# EAGLE design adapterV0.2 (EAGLE 9.4.2)
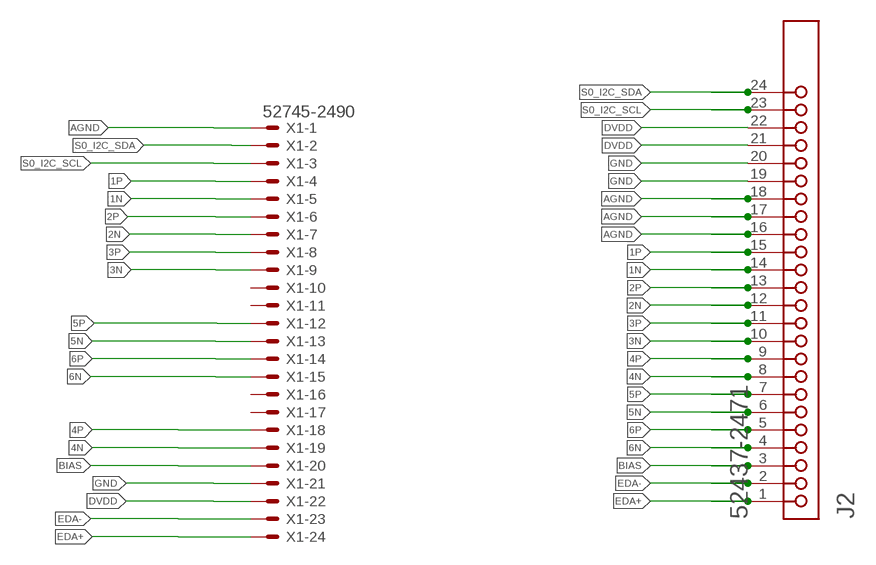
[diagram p0: schematic, sheet 1]

## Parts
J2  MOLEX_52437-247_FLEX  [MOLEX_52437-2471_FLEX]
X1  52745-2490  [52745-2490]

## Nets
1N: J2.14 X1.5
1P: J2.15 X1.4
2N: J2.12 X1.7
2P: J2.13 X1.6
3N: J2.10 X1.9
3P: J2.11 X1.8
4N: J2.8 X1.19
4P: J2.9 X1.18
5N: J2.6 X1.13
5P: J2.7 X1.12
6N: J2.4 X1.15
6P: J2.5 X1.14
AGND: J2.16 J2.17 J2.18 X1.1
BIAS: J2.3 X1.20
DVDD: J2.21 J2.22 X1.22
EDA+: J2.1 X1.24
EDA-: J2.2 X1.23
GND: J2.19 J2.20 X1.21
S0_I2C_SCL: J2.23 X1.3
S0_I2C_SDA: J2.24 X1.2
Unconnected: X1.10 X1.11 X1.16 X1.17

## Library data of the parts
J2 = Molex - 52437-2471:MOLEX_52437-247_FLEX: MOLX-52437-2471
X1 = con-molex:52745-2490: FFC/FPC-to-Board 0.50mm (.020") SMT Top Contact Right Angle, ZIF, Style Receptacle 52745 / 52435 Source: http://www.molex.com/product/ffc/52745.html; MF: MOLEX; OC_FARNELL: unknown; OC_NEWARK: unknown

## Net classes
0 default: width 0.19 mm, drill 0.19 mm

## Board
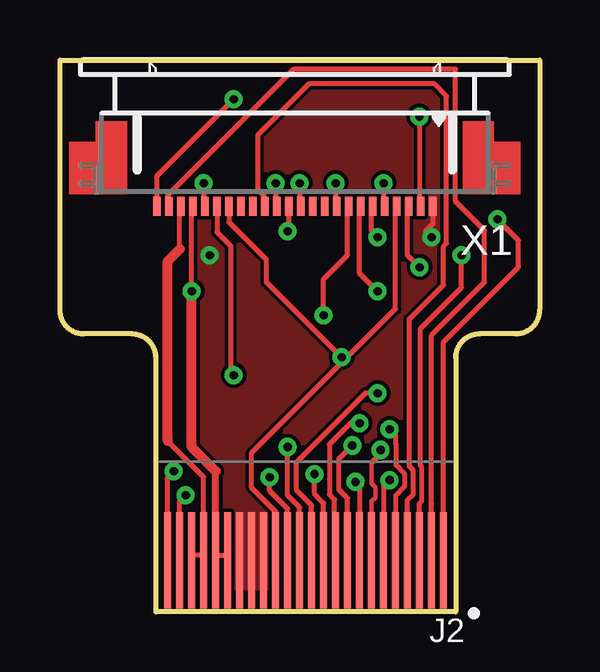
[diagram p1: board, top side]
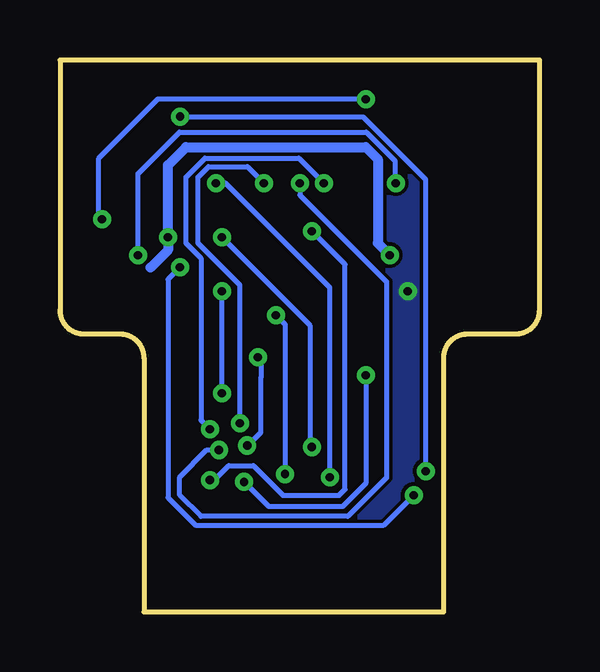
[diagram p2: board, bottom side, seen from below]

Size 20 x 23 mm. Coordinates in mm from the lower left corner, seen from the top.
Outline: 0,12.58 0,23 20,23 20,12.58 20,12.55 20,12.51 19.99,12.48 19.99,12.45 19.99,12.41 19.98,12.38 19.97,12.35 19.96,12.31 19.95,12.28 19.94,12.25 19.93,12.22 19.92,12.18 19.9,12.15 19.89,12.12 19.87,12.09 19.85,12.06 19.84,12.03 19.82,12.01 19.8,11.98 19.78,11.95 19.75,11.93 19.73,11.9 19.71,11.88 19.68,11.85 19.66,11.83 19.63,11.81 19.6,11.79 19.58,11.77 19.55,11.75 19.52,11.73 19.49,11.71 19.46,11.7 19.43,11.68 19.4,11.67 19.37,11.65 19.33,11.64 19.3,11.63 19.27,11.62 19.24,11.61 19.2,11.6 19.17,11.6 19.14,11.59 19.1,11.59 19.07,11.59 19.03,11.58 19,11.58 17.5,11.58 17.47,11.58 17.43,11.58 17.4,11.58 17.36,11.57 17.33,11.57 17.3,11.56 17.26,11.55 17.23,11.55 17.2,11.54 17.16,11.53 17.13,11.51 17.1,11.5 17.07,11.49 17.04,11.47 17.01,11.45 16.98,11.44 16.95,11.42 16.92,11.4 16.9,11.38 16.87,11.36 16.84,11.34 16.82,11.31 16.79,11.29 16.77,11.27 16.75,11.24 16.72,11.21 16.7,11.19 16.68,11.16 16.66,11.13 16.65,11.1 16.63,11.07 16.61,11.04 16.6,11.01 16.58,10.98 16.57,10.95 16.56,10.92 16.55,10.89 16.54,10.85 16.53,10.82 16.52,10.79 16.51,10.75 16.51,10.72 16.5,10.69 16.5,10.65 16.5,10.62 16.5,10.58 16.5,0 4,0 4,10.58 4,10.62 4,10.65 3.99,10.69 3.99,10.72 3.99,10.75 3.98,10.79 3.97,10.82 3.96,10.85 3.95,10.89 3.94,10.92 3.93,10.95 3.92,10.98 3.9,11.01 3.89,11.04 3.87,11.07 3.85,11.1 3.84,11.13 3.82,11.16 3.8,11.19 3.78,11.21 3.75,11.24 3.73,11.27 3.71,11.29 3.68,11.31 3.66,11.34 3.63,11.36 3.6,11.38 3.58,11.4 3.55,11.42 3.52,11.44 3.49,11.45 3.46,11.47 3.43,11.49 3.4,11.5 3.37,11.51 3.33,11.53 3.3,11.54 3.27,11.55 3.24,11.55 3.2,11.56 3.17,11.57 3.14,11.57 3.1,11.58 3.07,11.58 3.03,11.58 3,11.58 1,11.58 0.97,11.58 0.93,11.59 0.9,11.59 0.86,11.59 0.83,11.6 0.8,11.6 0.76,11.61 0.73,11.62 0.7,11.63 0.66,11.64 0.63,11.65 0.6,11.67 0.57,11.68 0.54,11.7 0.51,11.71 0.48,11.73 0.45,11.75 0.42,11.77 0.4,11.79 0.37,11.81 0.34,11.83 0.32,11.85 0.29,11.88 0.27,11.9 0.25,11.93 0.22,11.95 0.2,11.98 0.18,12.01 0.16,12.03 0.15,12.06 0.13,12.09 0.11,12.12 0.1,12.15 0.08,12.18 0.07,12.22 0.06,12.25 0.05,12.28 0.04,12.31 0.03,12.35 0.02,12.38 0.01,12.41 0.01,12.45 0,12.48 0,12.51 0,12.55 0,12.58
Copper layers (1*16): Top 0.035mm / dielectric 1.5mm / Bottom 0.035mm
Design rules "default *": minimum track width 6mil, minimum drill 0.35mm, track to track 6mil, track to pad 6mil, pad to pad 6mil, via to via 6mil, smd to smd 6mil, copper to edge 6mil, drill to drill 6mil, minimum pad ring 10mil, minimum via ring 8mil, stop-mask expansion 4mil, vias tented up to drill 0mil, thermal gap 10mil

### Footprints (pad centres in the part's own frame; a part is rotated, then mirrored left to right if it is on the bottom)
MOLEX_52437-2471_FLEX = smd 0.3 x 4: 1 0.15,2; 2 0.65,2; 3 1.15,2; 4 1.65,2; 5 2.15,2; 6 2.65,2; 7 3.15,2; 8 3.65,2; 9 4.15,2; 10 4.65,2; 11 5.15,2; 12 5.65,2; 13 6.15,2; 14 6.65,2; 15 7.15,2; 16 7.65,2; 17 8.15,2; 18 8.65,2; 19 9.15,2; 20 9.65,2; 21 10.15,2; 22 10.65,2; 23 11.15,2; 24 11.65,2
52745-2490 = smd 0.3 x 0.8: 1 -5.75,2.5; 2 -5.25,2.5; 3 -4.75,2.5; 4 -4.25,2.5; 5 -3.75,2.5; 6 -3.25,2.5; 7 -2.75,2.5; 8 -2.25,2.5; 9 -1.75,2.5; 10 -1.25,2.5; 11 -0.75,2.5; 12 -0.25,2.5; 13 0.25,2.5; 14 0.75,2.5; 15 1.25,2.5; 16 1.75,2.5; 17 2.25,2.5; 18 2.75,2.5; 19 3.25,2.5; 20 3.75,2.5; 21 4.25,2.5; 22 4.75,2.5; 23 5.25,2.5; 24 5.75,2.5

### Placement (x,y rotation side)
J2  16.14,4.16 180 top
X1  9.79,19.4 180 top

### Tracks (layer width: path | path; a pad name or v marks a point on that pad's centre or on a via)
1N  (via drill 0.35)
  Top 0.203: v13.49,17.86 13.49,17.11 X1.5 | v8.74,5.61 8.74,5.05 9.49,4.3 9.49,2.36 J2.14
  Bottom 0.203: v13.49,17.86 13.09,17.86 8.74,13.51 v8.74,5.61
1P
  Top 0.203: X1.4 13.99,16.86 13.99,12.63 7.99,6.63 7.99,5.18 8.99,4.18 8.99,2.36 J2.15
2N  (via drill 0.35)
  Top 0.203: v13.24,13.36 12.49,14.11 12.49,16.86 X1.7 | v13.24,9.11 12.73,9.11 9.86,6.25 9.86,5.07 10.49,4.44 10.49,2.36 J2.12
  Bottom 0.203: v13.24,9.11 v13.24,13.36
2P  (via drill 0.35)
  Top 0.203: v13.24,15.61 12.99,15.86 12.99,16.86 X1.6 | v9.49,6.87 9.49,4.86 9.99,4.36 9.99,2.36 J2.13
  Bottom 0.203: v13.24,15.61 9.55,11.92 9.55,6.93 v9.49,6.87
3N  (via drill 0.35)
  Top 0.203: v11.49,17.86 11.49,17.11 X1.9 | v12.49,7.86 12.11,7.86 11.24,6.99 11.24,4.9 11.46,4.68 J2.10
  Bottom 0.203: v11.49,17.86 12.18,18.55 13.8,18.55 14.24,18.11 14.24,15.37 12.49,13.62 v12.49,7.86
3P  (via drill 0.35)
  Top 0.203: v10.99,12.36 10.99,13.86 11.99,14.86 11.99,16.86 X1.8 | v10.61,5.74 10.61,4.92 10.99,4.54 10.99,2.36 J2.11
  Bottom 0.203: v10.99,12.36 10.61,11.98 10.61,5.86 v10.61,5.74
4N  (via drill 0.35)
  Top 0.203: v7.24,9.86 7.12,9.98 7.12,15.25 6.54,15.83 X1.19 | v12.32,5.42 12.49,5.42 J2.8
  Bottom 0.203: v7.24,9.86 7.24,5.36 8.21,4.39 11.29,4.39 v12.32,5.42
4P  (via drill 0.35)
  Top 0.203: J2.9 11.99,2.36 11.99,4.74 11.63,5.1 11.63,6.37 v12.19,6.94 | v11.74,10.61 8.61,13.74 8.61,14.68 7.04,16.25 X1.18
  Bottom 0.203: v11.74,10.61 11.61,10.49 11.61,9.77 11.62,9.77 11.62,7.49 v12.18,6.92 v12.19,6.94
5N  (via drill 0.35)
  Top 0.203: X1.13 9.54,15.88 9.52,15.86 v9.49,15.86 | J2.6 13.49,5.24 v13.74,5.49
  Bottom 0.203: v9.49,15.86 8.11,14.48 8.11,5.11 8.36,4.86 10.7,4.86 11.93,6.09 12.96,6.09 13.56,5.49 v13.74,5.49
5P  (via drill 0.35)
  Top 0.19: J2.7 12.99,4.61 13.15,4.76 13.15,5.2 12.99,5.36 12.99,6.22
  Top 0.203: v9.99,17.86 9.99,17.11 X1.12 | J2.7 12.99,2.36 | 12.99,6.22 13.37,6.6 v13.37,6.75
  Bottom 0.203: v9.99,17.86 9.99,17.36 6.37,13.74 6.37,5.61 7.99,3.99 14.12,3.99 15,4.87 15,5.62 13.88,6.75 v13.37,6.75
6N
  Top 0.203: X1.15 8.49,17.11 8.49,17.36 8.24,17.61 8.24,17.86 8.24,18.11 8.24,19.86 10.38,22 15.63,22 16.12,21.5 16.12,15.35 15.99,15.22 15.99,13.61 14.56,12.19 14.56,6.07 14.73,5.9 14.73,4.9 14.49,4.67 14.49,2.36 J2.4
6P  (via drill 0.35)
  Top 0.203: v8.99,17.86 8.99,17.11 X1.14 | v13.74,7.61 14,7.36 13.99,7.36 13.99,7.02 14,7.01 14,6.13 14.37,5.75 14.37,5.23 13.99,4.85 13.99,2.36 J2.5
  Bottom 0.203: v13.74,7.61 14.12,8 14.12,14.75 14.74,15.36 14.74,18.12 13.95,18.91 10.03,18.91 v8.99,17.86
AGND  (via drill 0.35)
  Top 0.203: X1.1 15.54,16.17 15.24,15.86 v15.49,15.61
  Bottom 0.406: 16.22,14.35 15.49,15.08 v15.49,15.61 15.49,18.61 14.74,19.36 7.24,19.36 6.74,18.86 6.74,15.36 v6.24,14.86
  pour Top (no thermals): 2,22 18.5,22 18.5,12.58 17.5,12.58 17.43,12.58 17.36,12.58 17.3,12.57 17.23,12.56 17.16,12.55 17.09,12.54 17.03,12.53 16.96,12.51 16.89,12.49 16.83,12.47 16.77,12.44 16.7,12.42 16.64,12.39 16.58,12.36 16.52,12.33 16.46,12.29 16.4,12.26 16.35,12.22 16.29,12.18 16.24,12.13 16.19,12.09 16.13,12.05 16.09,12 16.04,11.95 15.99,11.9 15.95,11.85 15.91,11.79 15.87,11.74 15.83,11.68 15.79,11.62 15.76,11.56 15.72,11.5 15.69,11.44 15.67,11.38 15.64,11.32 15.62,11.25 15.59,11.19 15.57,11.12 15.56,11.06 15.54,10.99 15.53,10.92 15.52,10.86 15.51,10.79 15.5,10.72 15.5,10.65 15.5,10.58 15.5,1 5,1 5,10.58 5,10.65 5,10.72 4.99,10.79 4.98,10.86 4.97,10.92 4.96,10.99 4.94,11.06 4.93,11.12 4.91,11.19 4.88,11.25 4.86,11.32 4.83,11.38 4.81,11.44 4.78,11.5 4.74,11.56 4.71,11.62 4.67,11.68 4.63,11.74 4.59,11.79 4.55,11.85 4.51,11.9 4.46,11.95 4.41,12 4.37,12.05 4.31,12.09 4.26,12.13 4.21,12.18 4.15,12.22 4.1,12.26 4.04,12.29 3.98,12.33 3.92,12.36 3.86,12.39 3.8,12.42 3.73,12.44 3.67,12.47 3.61,12.49 3.54,12.51 3.47,12.53 3.41,12.54 3.34,12.55 3.27,12.56 3.2,12.57 3.14,12.58 3.07,12.58 3,12.58 2,12.58
BIAS  (via drill 0.35)
  Top 0.203: v5.99,17.86 5.99,17.11 X1.20 | J2.3 14.99,2.36 14.99,4.52 15.08,4.62 15.08,6.05 15.03,6.11 15.03,11.79 16.74,13.51 v16.74,14.86
  Bottom 0.203: v16.74,14.86 16.74,18.27 15.01,20 7.23,20 6.03,18.8 6.03,17.9 v5.99,17.86
DVDD
  Top 0.203: 4.99,15.11 4.99,16.86 X1.22 | 4.49,7.11 5.99,5.61 5.99,2.36 | 5.99,2.36 5.49,2.36 J2.22 | 5.99,2.36 J2.21
  Top 0.406: 4.99,15.11 4.49,14.61 4.49,7.11
EDA+  (via drill 0.35)
  Top 0.203: X1.24 4.04,18.17 v7.24,21.36 | J2.1 15.99,11.24 19.12,14.37 19.12,15.48 v18.24,16.36
  Bottom 0.203: v18.24,16.36 18.24,16.55 18.41,16.71 18.41,18.88 15.92,21.36 v7.24,21.36
EDA-
  Top 0.203: X1.23 4.49,17.11 4.49,17.36 9.74,22.61 16.49,22.61 16.49,17.11 17.71,15.9 17.71,13.74 15.5,11.53 15.5,4.5 15.49,4.49 15.49,2.36 J2.2
GND  (via drill 0.35)
  Top 0.203: v5.49,13.36 5.49,16.86 X1.21 | J2.19 6.99,2.36 6.49,2.36 J2.20
  Top 0.3: 6.49,2.36 6.49,5.87
  Top 0.406: v5.49,13.36 5.49,6.87 6.49,5.87
  pour Bottom: 2,22 18.5,22 18.5,12.58 17.5,12.58 17.43,12.58 17.36,12.58 17.3,12.57 17.23,12.56 17.16,12.55 17.09,12.54 17.03,12.53 16.96,12.51 16.89,12.49 16.83,12.47 16.77,12.44 16.7,12.42 16.64,12.39 16.58,12.36 16.52,12.33 16.46,12.29 16.4,12.26 16.35,12.22 16.29,12.18 16.24,12.13 16.19,12.09 16.13,12.05 16.09,12 16.04,11.95 15.99,11.9 15.95,11.85 15.91,11.79 15.87,11.74 15.83,11.68 15.79,11.62 15.76,11.56 15.72,11.5 15.69,11.44 15.67,11.38 15.64,11.32 15.62,11.25 15.59,11.19 15.57,11.12 15.56,11.06 15.54,10.99 15.53,10.92 15.52,10.86 15.51,10.79 15.5,10.72 15.5,10.65 15.5,10.58 15.5,1 5,1 5,10.58 5,10.65 5,10.72 4.99,10.79 4.98,10.86 4.97,10.92 4.96,10.99 4.94,11.06 4.93,11.12 4.91,11.19 4.88,11.25 4.86,11.32 4.83,11.38 4.81,11.44 4.78,11.5 4.74,11.56 4.71,11.62 4.67,11.68 4.63,11.74 4.59,11.79 4.55,11.85 4.51,11.9 4.46,11.95 4.41,12 4.37,12.05 4.31,12.09 4.26,12.13 4.21,12.18 4.15,12.22 4.1,12.26 4.04,12.29 3.98,12.33 3.92,12.36 3.86,12.39 3.8,12.42 3.73,12.44 3.67,12.47 3.61,12.49 3.54,12.51 3.47,12.53 3.41,12.54 3.34,12.55 3.27,12.56 3.2,12.57 3.14,12.58 3.07,12.58 3,12.58 2,12.58
S0_I2C_SCL  (via drill 0.35)
  Top 0.203: v14.99,14.36 14.49,14.86 14.49,16.86 X1.3 | v5.24,4.86 4.99,4.61 4.99,2.36 J2.23
  Bottom 0.203: v14.99,14.36 15.5,13.86 15.5,4.77 14.34,3.61 6.49,3.61 v5.24,4.86
S0_I2C_SDA  (via drill 0.35)
  Top 0.203: v14.99,20.64 v14.99,20.63 14.99,17.11 X1.2 | v4.74,5.86 4.49,5.61 4.49,2.36 J2.24
  Bottom 0.203: v14.99,20.64 14.97,20.62 7.35,20.62 4.74,18.01 v4.74,5.86